# EAGLE design mymote-power (EAGLE 8.2.1)
PROJECT_AUTHOR: TINKERMAN <xose.perez@gmail.com>; PROJECT_LICENSE: CC-SA-BY 3.0; PROJECT_NAME: MYMOTE QUAKE; PROJECT_VERSION: 0.1.20170508
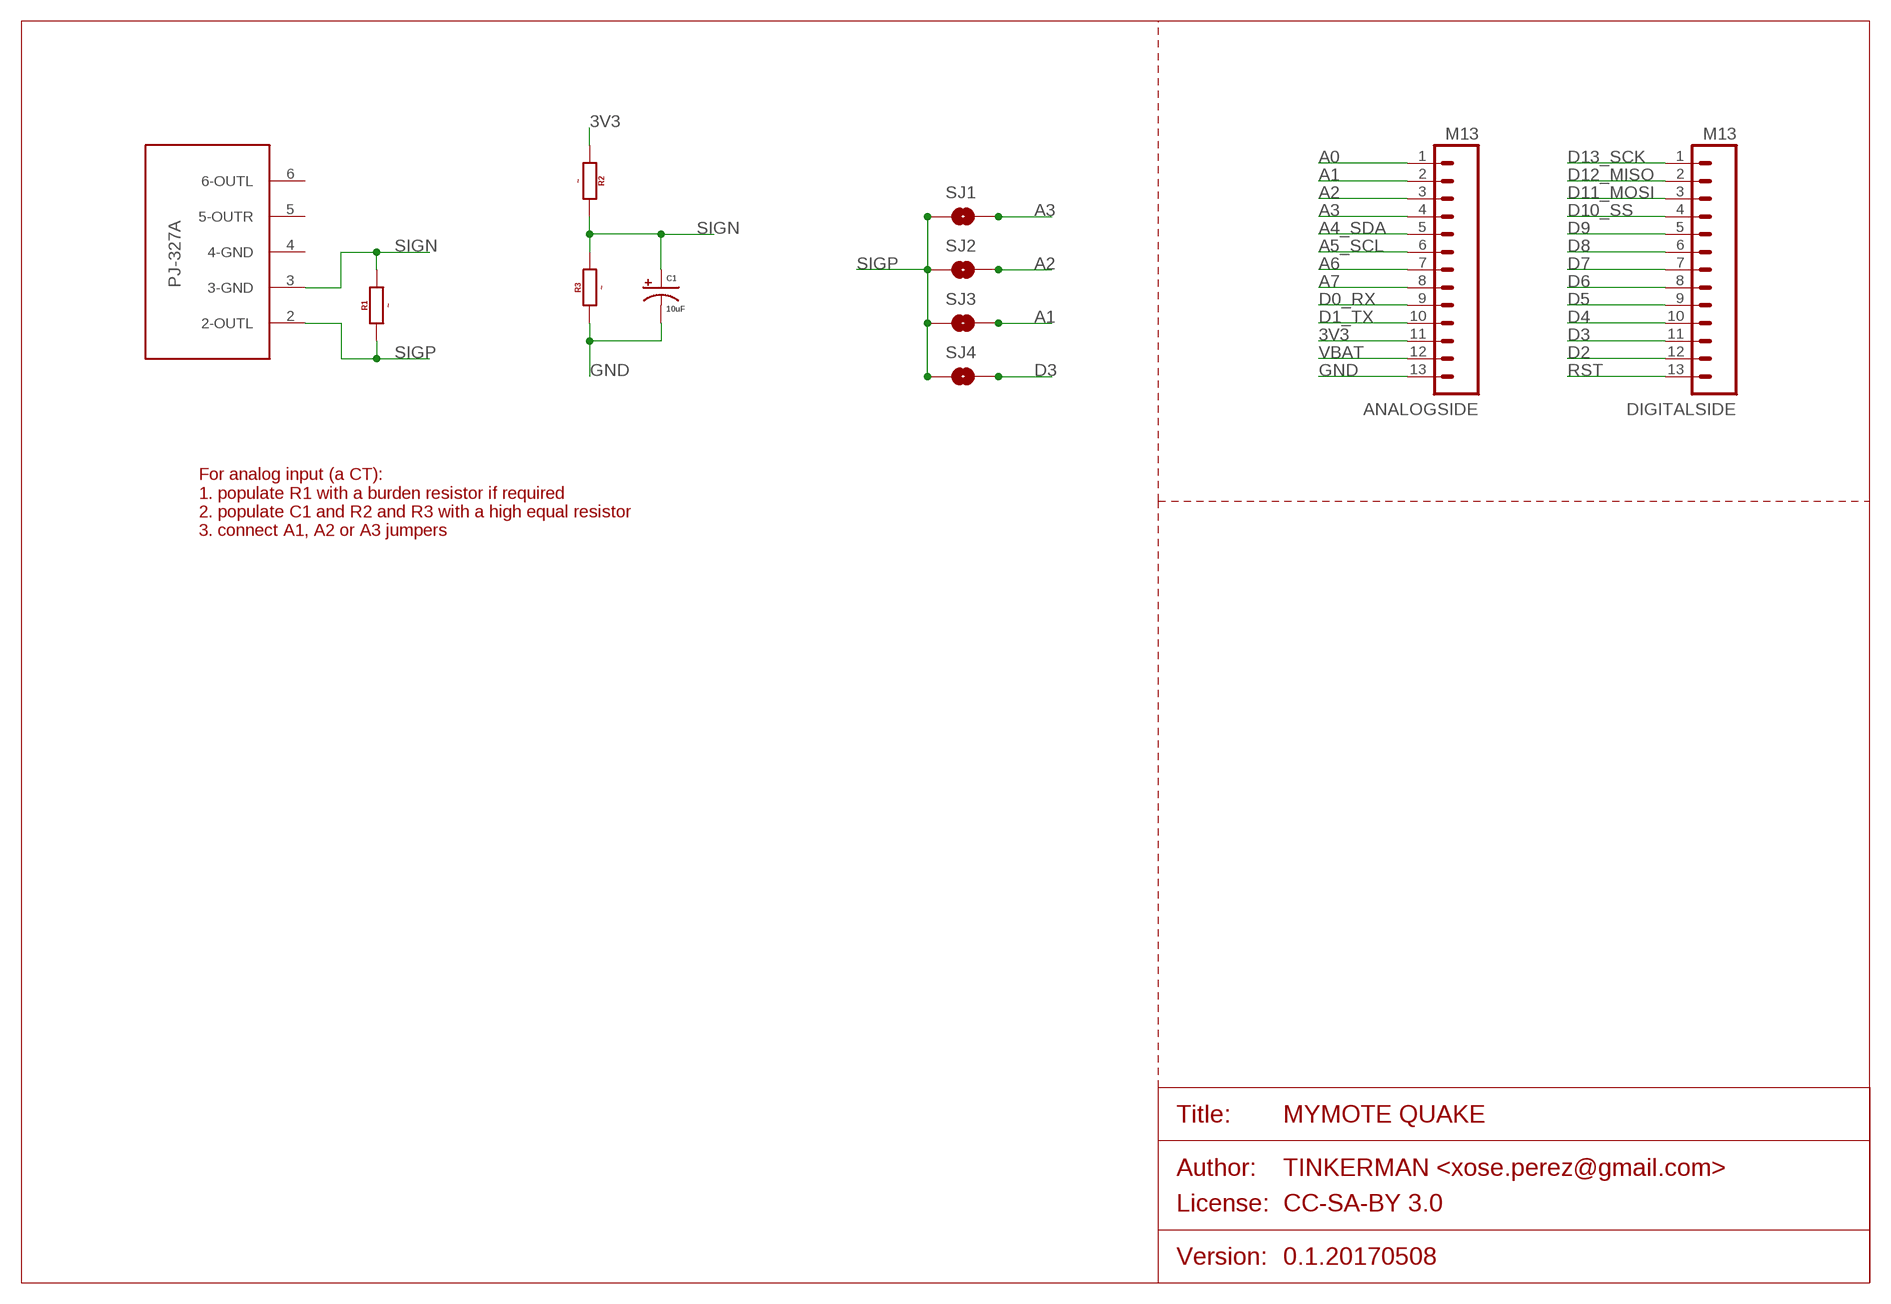
[diagram p0: schematic, sheet 1]

## Parts
ANALOGSIDE  M13  [1X13_NO_SILK]
C1  10uF  CAP_POLC  [PANASONIC_C]
CURR1  PJ-327A  [PJ-327A]
DIGITALSIDE  M13  [1X13_NO_SILK]
R1  ~  RESISTOR0805  [0805]
R2  ~  RESISTOR0805  [0805]
R3  ~  RESISTOR0805  [0805]
SJ1  SOLDERJUMPERNO  [SJ_2S-NO]
SJ2  SOLDERJUMPERNO  [SJ_2S-NO]
SJ3  SOLDERJUMPERNO  [SJ_2S-NO]
SJ4  SOLDERJUMPERNO  [SJ_2S-NO]

## Nets
3V3: ANALOGSIDE.11 R2.1
A0: ANALOGSIDE.1
A1: ANALOGSIDE.2 SJ3.2
A2: ANALOGSIDE.3 SJ2.2
A3: ANALOGSIDE.4 SJ1.2
A4_SDA: ANALOGSIDE.5
A5_SCL: ANALOGSIDE.6
A6: ANALOGSIDE.7
A7: ANALOGSIDE.8
D0_RX: ANALOGSIDE.9
D1_TX: ANALOGSIDE.10
D2: DIGITALSIDE.12
D3: DIGITALSIDE.11 SJ4.2
D4: DIGITALSIDE.10
D5: DIGITALSIDE.9
D6: DIGITALSIDE.8
D7: DIGITALSIDE.7
D8: DIGITALSIDE.6
D9: DIGITALSIDE.5
D10_SS: DIGITALSIDE.4
D11_MOSI: DIGITALSIDE.3
D12_MISO: DIGITALSIDE.2
D13_SCK: DIGITALSIDE.1
GND [power]: ANALOGSIDE.13 C1.- R3.1
RST: DIGITALSIDE.13
SIGN: C1.+ CURR1.3(3-GND) R1.2 R2.2 R3.2
SIGP: CURR1.2(2-OUTL) R1.1 SJ1.1 SJ2.1 SJ3.1 SJ4.1
VBAT: ANALOGSIDE.12
Unconnected: CURR1.4(4-GND) CURR1.5(5-OUTR) CURR1.6(6-OUTL)

## Notes on the sheet
- For analog input (a CT):
  1. populate R1 with a burden resistor if required
  2. populate C1 and R2 and R3 with a high equal resistor
  3. connect A1, A2 or A3 jumpers

## Library data of the parts
ANALOGSIDE DIGITALSIDE = xose:M13
C1 = xose:CAP_POL: Capacitor Polarized These are standard SMD and PTH capacitors. Normally 10uF, 47uF, and 100uF in electrolytic and tantalum varieties. Always verify the external diameter of the through hole cap, it varies with capacity, voltage, and manufacturer. The EIA devices should be standard.
CURR1 = PJ-327A:PJ-327A
R1-R3 = xose:RESISTOR: Generic EU resistor symbol
SJ1-SJ4 = xose:SOLDERJUMPER: Solder Jumper Standard SMD solder jumper. Used to automate production. Two varients : Normally Open and Normally Closed are the same, but have different paste layers. NC will have a large amount of paste and should jumper during reflow.

## Net classes
1 power: width 0.381 mm, clearance 0.254 mm

## Board
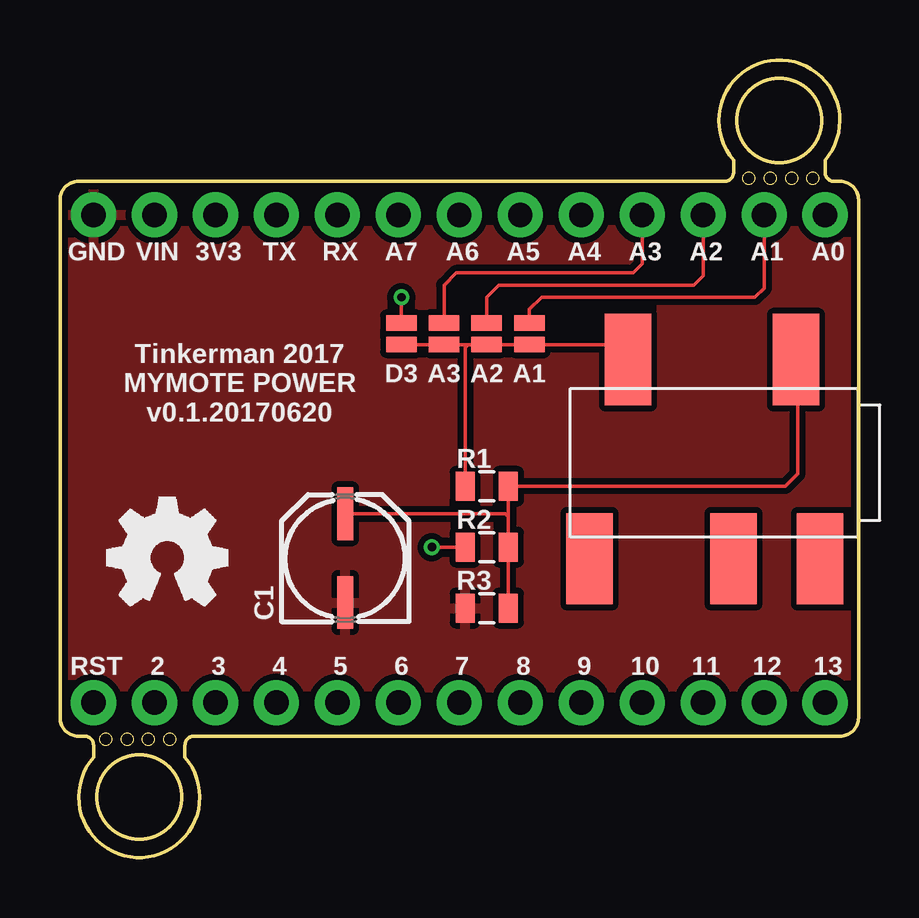
[diagram p1: board, top side]
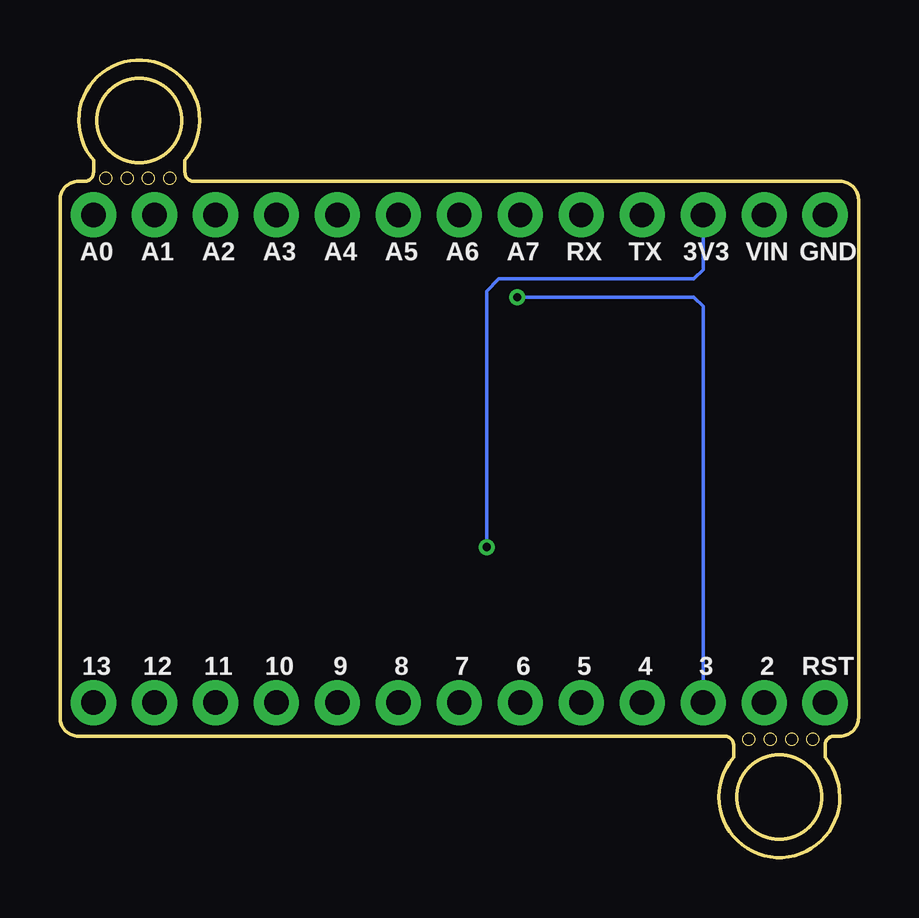
[diagram p2: board, bottom side, seen from below]

Size 33.27 x 33.23 mm. Coordinates in mm from the lower left corner, seen from the top.
Outline: 0.71,5.06 0.76,5.06
Outline: 0.76,28.17 0.71,28.17
Outline: 0,5.77 0,5.82
Outline: 0,27.41 0,27.46
Outline: 0,5.82 0,27.41
Outline: 0,27.41 arc-90 0.76,28.17
Outline: 0.76,5.06 1.02,5.06 arc-90 1.4,4.68 1.4,4.17 arc262 5.21,4.17 5.21,4.68 arc-90 5.59,5.06 32.51,5.06 arc90 33.27,5.82 33.27,27.41 arc90 32.51,28.17 32.26,28.17 arc-90 31.88,28.55 31.88,29.06 arc262 28.07,29.06 28.07,28.55 arc-90 27.69,28.17 0.76,28.17
Outline: 0.76,5.06 arc-90 0,5.82
Outline: circle at 3.3,2.52 radius 1.75
Outline: circle at 1.91,4.93 radius 0.25
Outline: circle at 2.79,4.93 radius 0.25
Outline: circle at 3.68,4.93 radius 0.25
Outline: circle at 29.97,30.71 radius 1.75
Outline: circle at 31.37,28.3 radius 0.25
Outline: circle at 30.48,28.3 radius 0.25
Outline: circle at 29.59,28.3 radius 0.25
Outline: circle at 4.57,4.93 radius 0.25
Outline: circle at 28.7,28.3 radius 0.25
Copper layers (1*16): Top 0.035mm / dielectric 1.5mm / Bottom 0.035mm
Design rules "seedstudio-2layer": minimum track width 6mil, minimum drill 12mil, track to track 6mil, track to pad 6mil, pad to pad 6mil, via to via 6mil, smd to smd 0mil, copper to edge 10mil, drill to drill 10mil, minimum pad ring 10mil, minimum via ring 6mil, stop-mask expansion 2mil, vias tented up to drill 100mil, thermal gap 10mil

### Footprints (pad centres in the part's own frame; a part is rotated, then mirrored left to right if it is on the bottom)
1X13_NO_SILK = drill 1.016 pad 1.88: 1 0,0; 2 2.54,0; 3 5.08,0; 4 7.62,0; 5 10.16,0; 6 12.7,0; 7 15.24,0; 8 17.78,0; 9 20.32,0; 10 22.86,0; 11 25.4,0; 12 27.94,0; 13 30.48,0
PANASONIC_C = smd 2.2 x 0.65: + 1.9,-0.2; - -1.8,-0.2
PJ-327A = smd 1.93 x 3.81: 2 9.1,-6.8; 3 2.1,-6.8; 4 1.1,1.5; 5 4.7,1.5; 6 10.7,1.5
0805 = smd 0.8 x 1.2: 1 -0.9,0; 2 0.9,0
SJ_2S-NO = smd 0.635 x 1.27: 1 -0.45,0; 2 0.45,0

### Placement (x,y rotation side)
ANALOGSIDE  31.88,26.77 180 top
C1  11.68,12.42 90 top
CURR1  32.77,13.95 180 top
DIGITALSIDE  31.88,6.45 180 top
R1  17.78,15.47 0 top
R2  17.78,12.93 0 top
R3  17.78,10.39 0 top
SJ1  16,21.82 90 top
SJ2  17.78,21.82 90 top
SJ3  19.56,21.82 90 top
SJ4  14.22,21.82 90 top

### Tracks (layer width: path | path; a pad name or v marks a point on that pad's centre or on a via)
3V3  (via drill 0.35)
  Top 0.152: R2.1 v15.49,12.93
  Bottom 0.152: ANALOGSIDE.11 6.48,24.49 6.86,24.11 14.99,24.11 15.49,23.6 v15.49,12.93
A1
  Top 0.152: ANALOGSIDE.2 29.34,23.73 28.96,23.35 20.07,23.35 19.56,22.84 SJ3.2
A2
  Top 0.152: ANALOGSIDE.3 26.8,24.23 26.42,23.85 18.29,23.85 17.78,23.35 SJ2.2
A3
  Top 0.152: ANALOGSIDE.4 24.26,24.74 23.88,24.36 16.51,24.36 16,23.85 SJ1.2
D3  (via drill 0.35)
  Top 0.152: SJ4.2 v14.22,23.35
  Bottom 0.152: DIGITALSIDE.11 6.48,22.96 6.86,23.35 v14.22,23.35
GND
  pour Top: -0.76,29.7 33.66,29.7 33.78,4.55 -0.64,4.55
SIGN
  Top 0.152: CURR1.3 30.73,20.68 30.73,15.98 30.23,15.47 R1.2 18.68,14.2 | R3.2 18.68,12.82 18.8,12.93 R2.2 18.68,14.2 | 18.68,14.2 18.56,14.32 C1.+
SIGP
  Top 0.152: 17.02,21.37 SJ1.1 SJ4.1 | 17.02,21.37 SJ2.1 SJ3.1 23.04,21.37 CURR1.2 | 17.02,21.37 16.88,21.23 R1.1

### Text on the board
tNames: GND | VIN | 3V3 | TX | RX | A7 | A6 | A5 | A4 | A3 | A2 | A1 | A0 | Tinkerman 2017 / MYMOTE POWER / v0.1.20170620 | D3 | A3 | A2 | A1 | RST | 2 | 3 | 4 | 5 | 6 | 7 | 8 | 9 | 10 | 11 | 12 | 13
bNames: GND | VIN | 3V3 | TX | RX | A7 | A6 | A5 | A4 | A3 | A2 | A1 | A0 | RST | 2 | 3 | 4 | 5 | 6 | 7 | 8 | 9 | 10 | 11 | 12 | 13